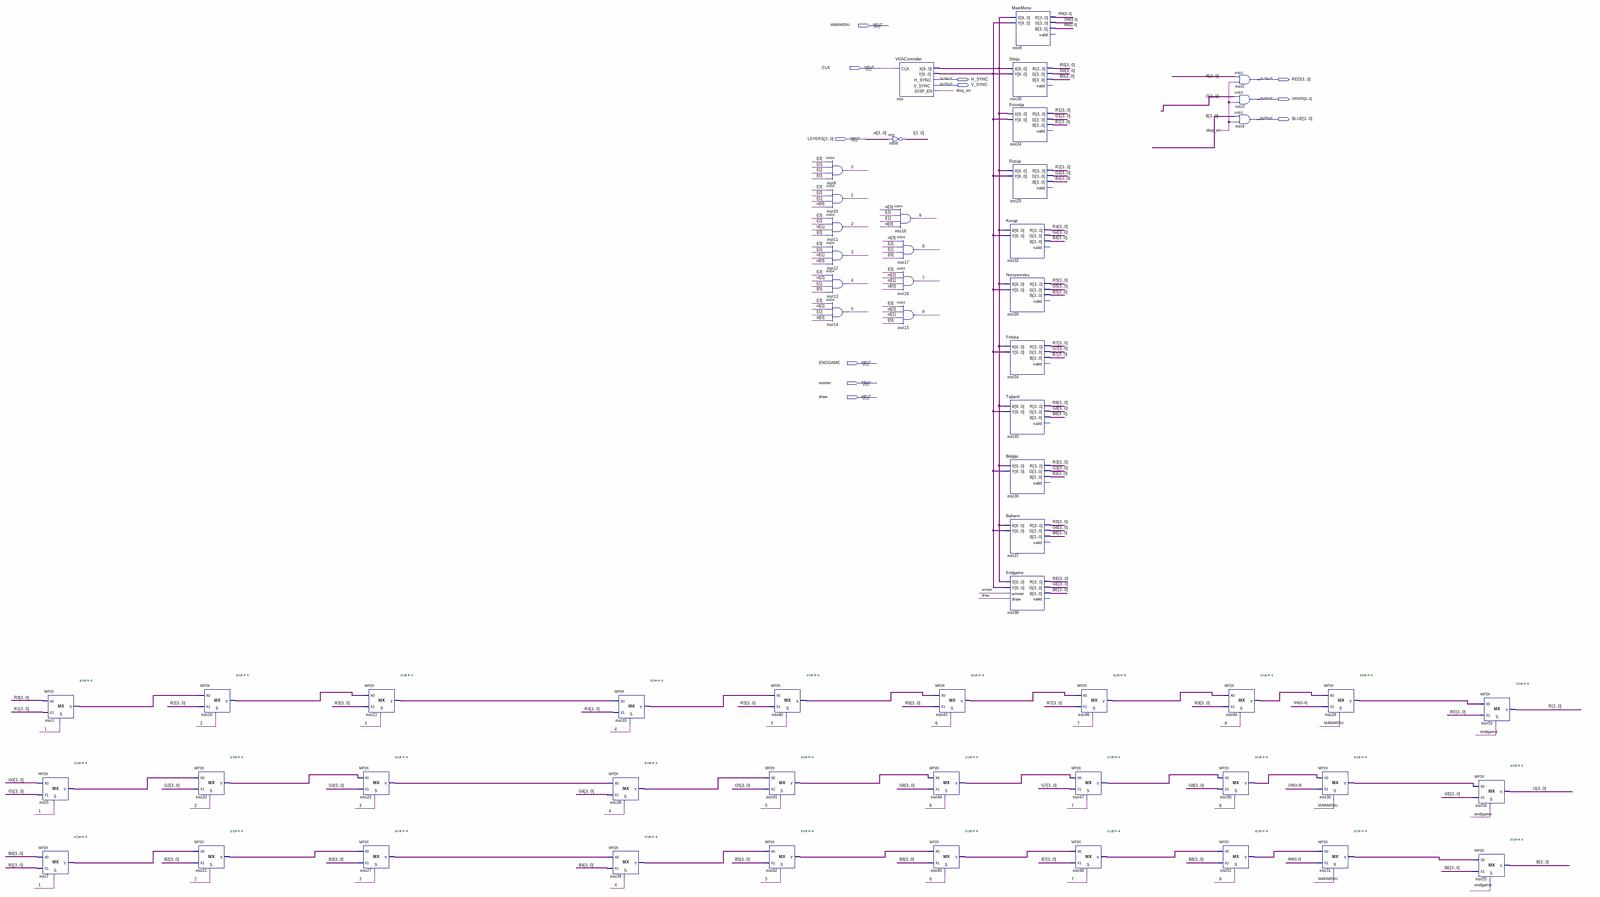
[diagram p0: schematic sheet, whole]
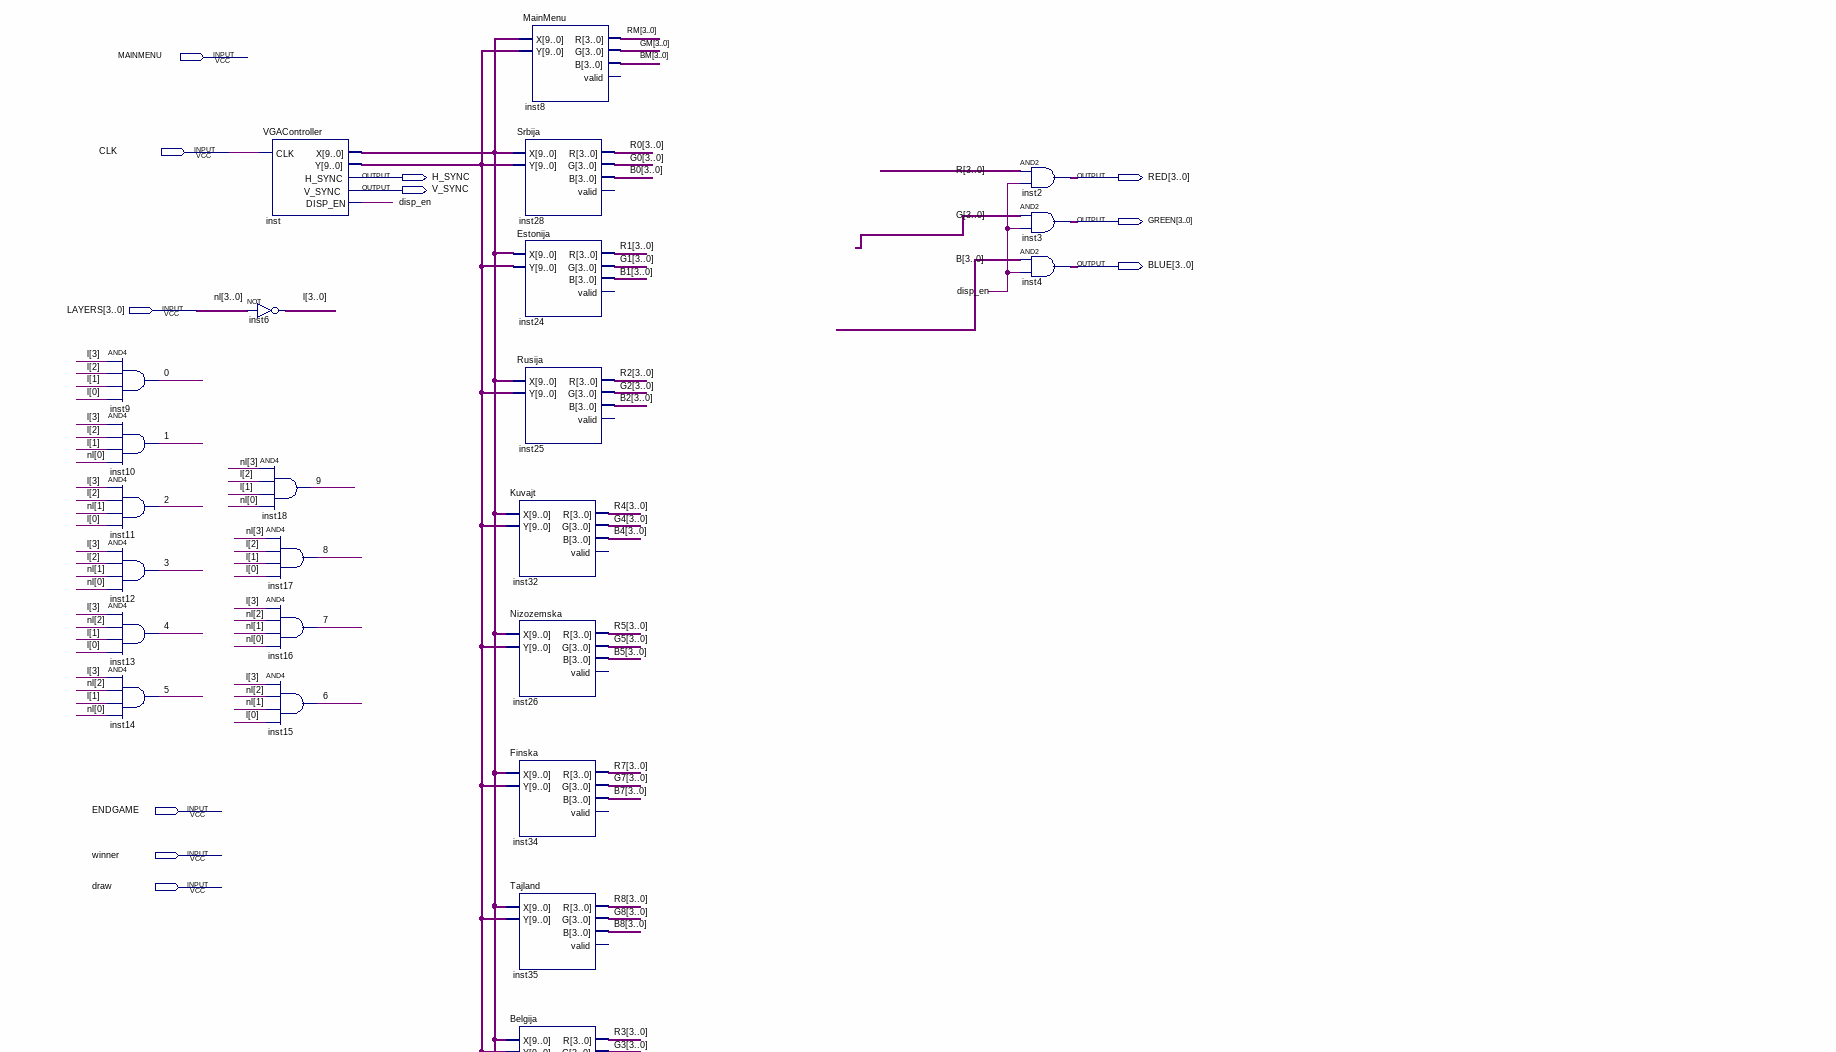
[diagram p1: schematic sheet, upper right part]
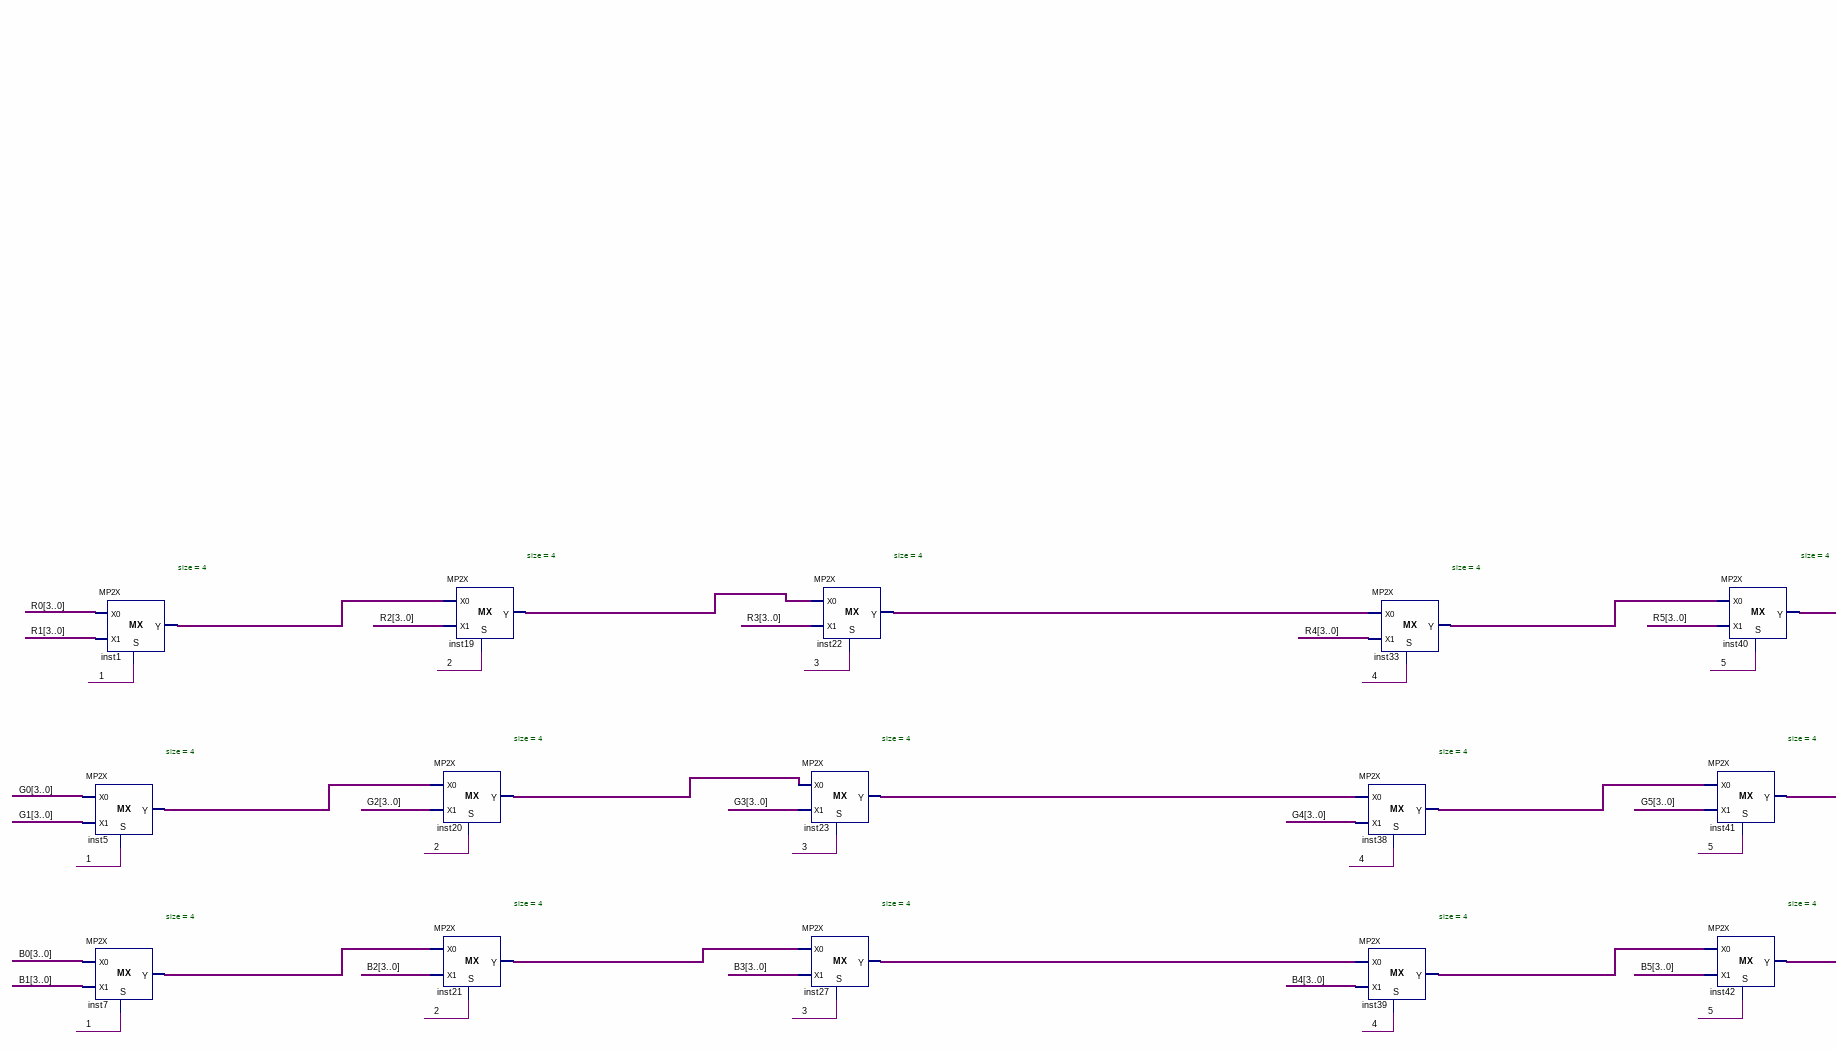
[diagram p2: schematic sheet, lower left part]
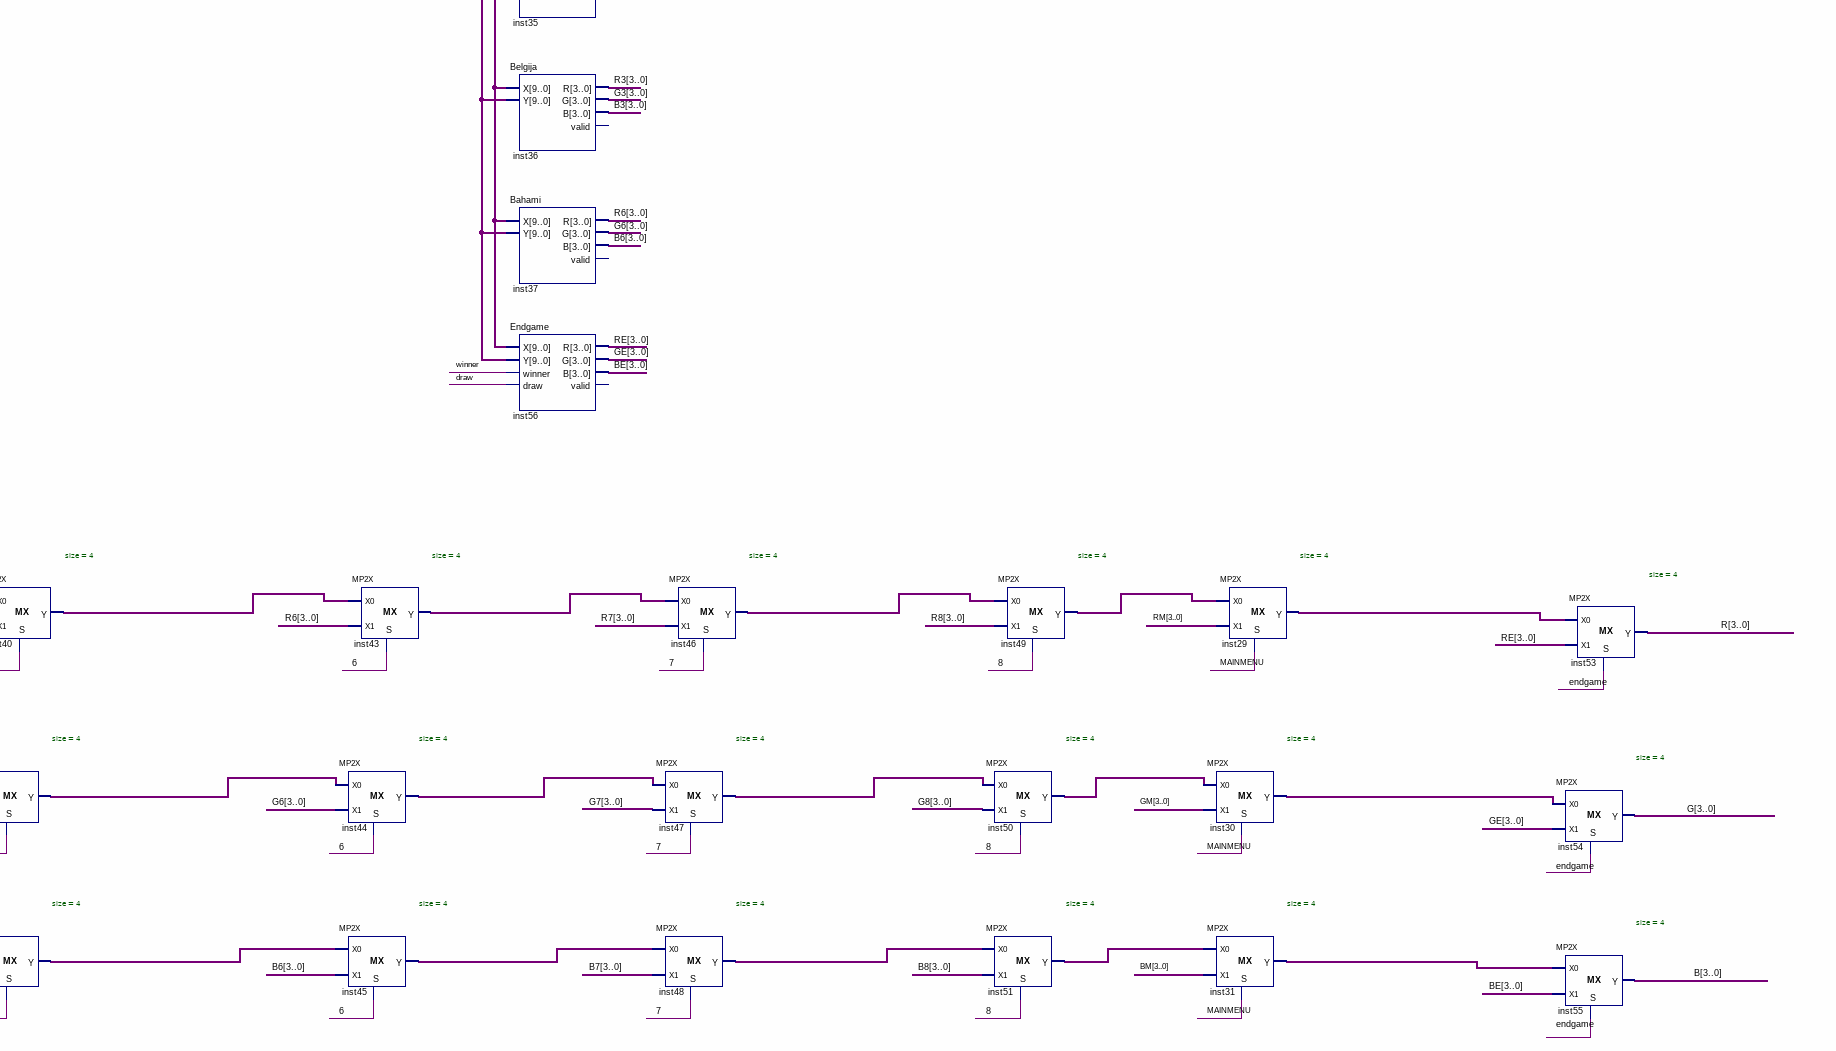
[diagram p3: schematic sheet, lower right part]
// Quartus schematic VGA.bdf as structural Verilog: 56 symbols, 11 pins
module VGA (
  input  MAINMENU,
  input  CLK,
  input  [3:0] LAYERS,
  input  ENDGAME,
  input  winner,
  input  draw,
  output H_SYNC,
  output [3:0] RED,
  output V_SYNC,
  output [3:0] GREEN,
  output [3:0] BLUE
);

  wire \0 , \1 , \2 , \3 , \4 , \5 , \6 , \7 , \8 , \9 , disp_en;
  wire [3:0] B, B0, B1, B2, B3, B4, B5, B6, B7, B8, BE, BM, G, G0, G1, G2, G3, G4, G5, G6, G7, G8, GE, GM,
       inst1_y, inst5_y, inst7_y, inst19_y, inst20_y, inst21_y, inst22_y, inst23_y, inst27_y, inst29_y,
       inst30_y, inst31_y, inst33_y, inst38_y, inst39_y, inst40_y, inst41_y, inst42_y, inst43_y, inst44_y,
       inst45_y, inst46_y, inst47_y, inst48_y, inst49_y, inst50_y, inst51_y, l, R, R0, R1, R2, R3, R4, R5,
       R6, R7, R8, RE, RM;
  wire [9:0] inst_x, inst_y;

  MP2X #(.size(4)) inst1 (.S(\1 ), .X0(R0), .X1(R1), .Y(inst1_y));
  MP2X #(.size(4)) inst5 (.S(\1 ), .X0(G0), .X1(G1), .Y(inst5_y));
  MP2X #(.size(4)) inst7 (.S(\1 ), .X0(B0), .X1(B1), .Y(inst7_y));
  MP2X #(.size(4)) inst19 (.S(\2 ), .X0(inst1_y), .X1(R2), .Y(inst19_y));
  MP2X #(.size(4)) inst20 (.S(\2 ), .X0(inst5_y), .X1(G2), .Y(inst20_y));
  MP2X #(.size(4)) inst21 (.S(\2 ), .X0(inst7_y), .X1(B2), .Y(inst21_y));
  MP2X #(.size(4)) inst22 (.S(\3 ), .X0(inst19_y), .X1(R3), .Y(inst22_y));
  MP2X #(.size(4)) inst23 (.S(\3 ), .X0(inst20_y), .X1(G3), .Y(inst23_y));
  MP2X #(.size(4)) inst27 (.S(\3 ), .X0(inst21_y), .X1(B3), .Y(inst27_y));
  MP2X #(.size(4)) inst33 (.S(\4 ), .X0(inst22_y), .X1(R4), .Y(inst33_y));
  MP2X #(.size(4)) inst38 (.S(\4 ), .X0(inst23_y), .X1(G4), .Y(inst38_y));
  MP2X #(.size(4)) inst39 (.S(\4 ), .X0(inst27_y), .X1(B4), .Y(inst39_y));
  MP2X #(.size(4)) inst40 (.S(\5 ), .X0(inst33_y), .X1(R5), .Y(inst40_y));
  MP2X #(.size(4)) inst41 (.S(\5 ), .X0(inst38_y), .X1(G5), .Y(inst41_y));
  MP2X #(.size(4)) inst42 (.S(\5 ), .X0(inst39_y), .X1(B5), .Y(inst42_y));
  and inst9 (\0 , l[3], l[2], l[1], l[0]);
  and inst10 (\1 , l[3], l[2], l[1], LAYERS[0]);
  and inst11 (\2 , l[3], l[2], LAYERS[1], l[0]);
  and inst12 (\3 , l[3], l[2], LAYERS[1], LAYERS[0]);
  and inst13 (\4 , l[3], LAYERS[2], l[1], l[0]);
  and inst14 (\5 , l[3], LAYERS[2], l[1], LAYERS[0]);
  VGAController inst (.CLK(CLK), .X(inst_x), .Y(inst_y), .H_SYNC(H_SYNC), .V_SYNC(V_SYNC), .DISP_EN(disp_en));
  assign l = ~LAYERS;  // NOT inst6, 4 bits wide
  and inst18 (\9 , LAYERS[3], l[2], l[1], LAYERS[0]);
  and inst17 (\8 , LAYERS[3], l[2], l[1], l[0]);
  and inst16 (\7 , l[3], LAYERS[2], LAYERS[1], LAYERS[0]);
  and inst15 (\6 , l[3], LAYERS[2], LAYERS[1], l[0]);
  MP2X #(.size(4)) inst43 (.S(\6 ), .X0(inst40_y), .X1(R6), .Y(inst43_y));
  MP2X #(.size(4)) inst44 (.S(\6 ), .X0(inst41_y), .X1(G6), .Y(inst44_y));
  MP2X #(.size(4)) inst45 (.S(\6 ), .X0(inst42_y), .X1(B6), .Y(inst45_y));
  Srbija inst28 (.X(inst_x), .Y(inst_y), .R(R0), .G(G0), .B(B0));  // open: valid
  Estonija inst24 (.X(inst_x), .Y(inst_y), .R(R1), .G(G1), .B(B1));  // open: valid
  Rusija inst25 (.X(inst_x), .Y(inst_y), .R(R2), .G(G2), .B(B2));  // open: valid
  Kuvajt inst32 (.X(inst_x), .Y(inst_y), .R(R4), .G(G4), .B(B4));  // open: valid
  Nizozemska inst26 (.X(inst_x), .Y(inst_y), .R(R5), .G(G5), .B(B5));  // open: valid
  Finska inst34 (.X(inst_x), .Y(inst_y), .R(R7), .G(G7), .B(B7));  // open: valid
  Tajland inst35 (.X(inst_x), .Y(inst_y), .R(R8), .G(G8), .B(B8));  // open: valid
  Belgija inst36 (.X(inst_x), .Y(inst_y), .R(R3), .G(G3), .B(B3));  // open: valid
  Bahami inst37 (.X(inst_x), .Y(inst_y), .R(R6), .G(G6), .B(B6));  // open: valid
  Endgame inst56 (.X(inst_x), .Y(inst_y), .winner(winner), .draw(draw), .R(RE), .G(GE), .B(BE));  // open: valid
  MainMenu inst8 (.X(inst_x), .Y(inst_y), .R(RM), .G(GM), .B(BM));  // open: valid
  MP2X #(.size(4)) inst46 (.S(\7 ), .X0(inst43_y), .X1(R7), .Y(inst46_y));
  MP2X #(.size(4)) inst47 (.S(\7 ), .X0(inst44_y), .X1(G7), .Y(inst47_y));
  MP2X #(.size(4)) inst48 (.S(\7 ), .X0(inst45_y), .X1(B7), .Y(inst48_y));
  assign RED = R & {4{disp_en}};  // AND2 inst2, 4 bits wide
  assign GREEN = G & {4{disp_en}};  // AND2 inst3, 4 bits wide
  assign BLUE = B & {4{disp_en}};  // AND2 inst4, 4 bits wide
  MP2X #(.size(4)) inst49 (.S(\8 ), .X0(inst46_y), .X1(R8), .Y(inst49_y));
  MP2X #(.size(4)) inst50 (.S(\8 ), .X0(inst47_y), .X1(G8), .Y(inst50_y));
  MP2X #(.size(4)) inst51 (.S(\8 ), .X0(inst48_y), .X1(B8), .Y(inst51_y));
  MP2X #(.size(4)) inst29 (.S(MAINMENU), .X0(inst49_y), .X1(RM), .Y(inst29_y));
  MP2X #(.size(4)) inst30 (.S(MAINMENU), .X0(inst50_y), .X1(GM), .Y(inst30_y));
  MP2X #(.size(4)) inst31 (.S(MAINMENU), .X0(inst51_y), .X1(BM), .Y(inst31_y));
  MP2X #(.size(4)) inst53 (.S(ENDGAME), .X0(inst29_y), .X1(RE), .Y(R));
  MP2X #(.size(4)) inst54 (.S(ENDGAME), .X0(inst30_y), .X1(GE), .Y(G));
  MP2X #(.size(4)) inst55 (.S(ENDGAME), .X0(inst31_y), .X1(BE), .Y(B));

  // Other names for the same wires on the sheet: nl[3:0] = LAYERS
endmodule
